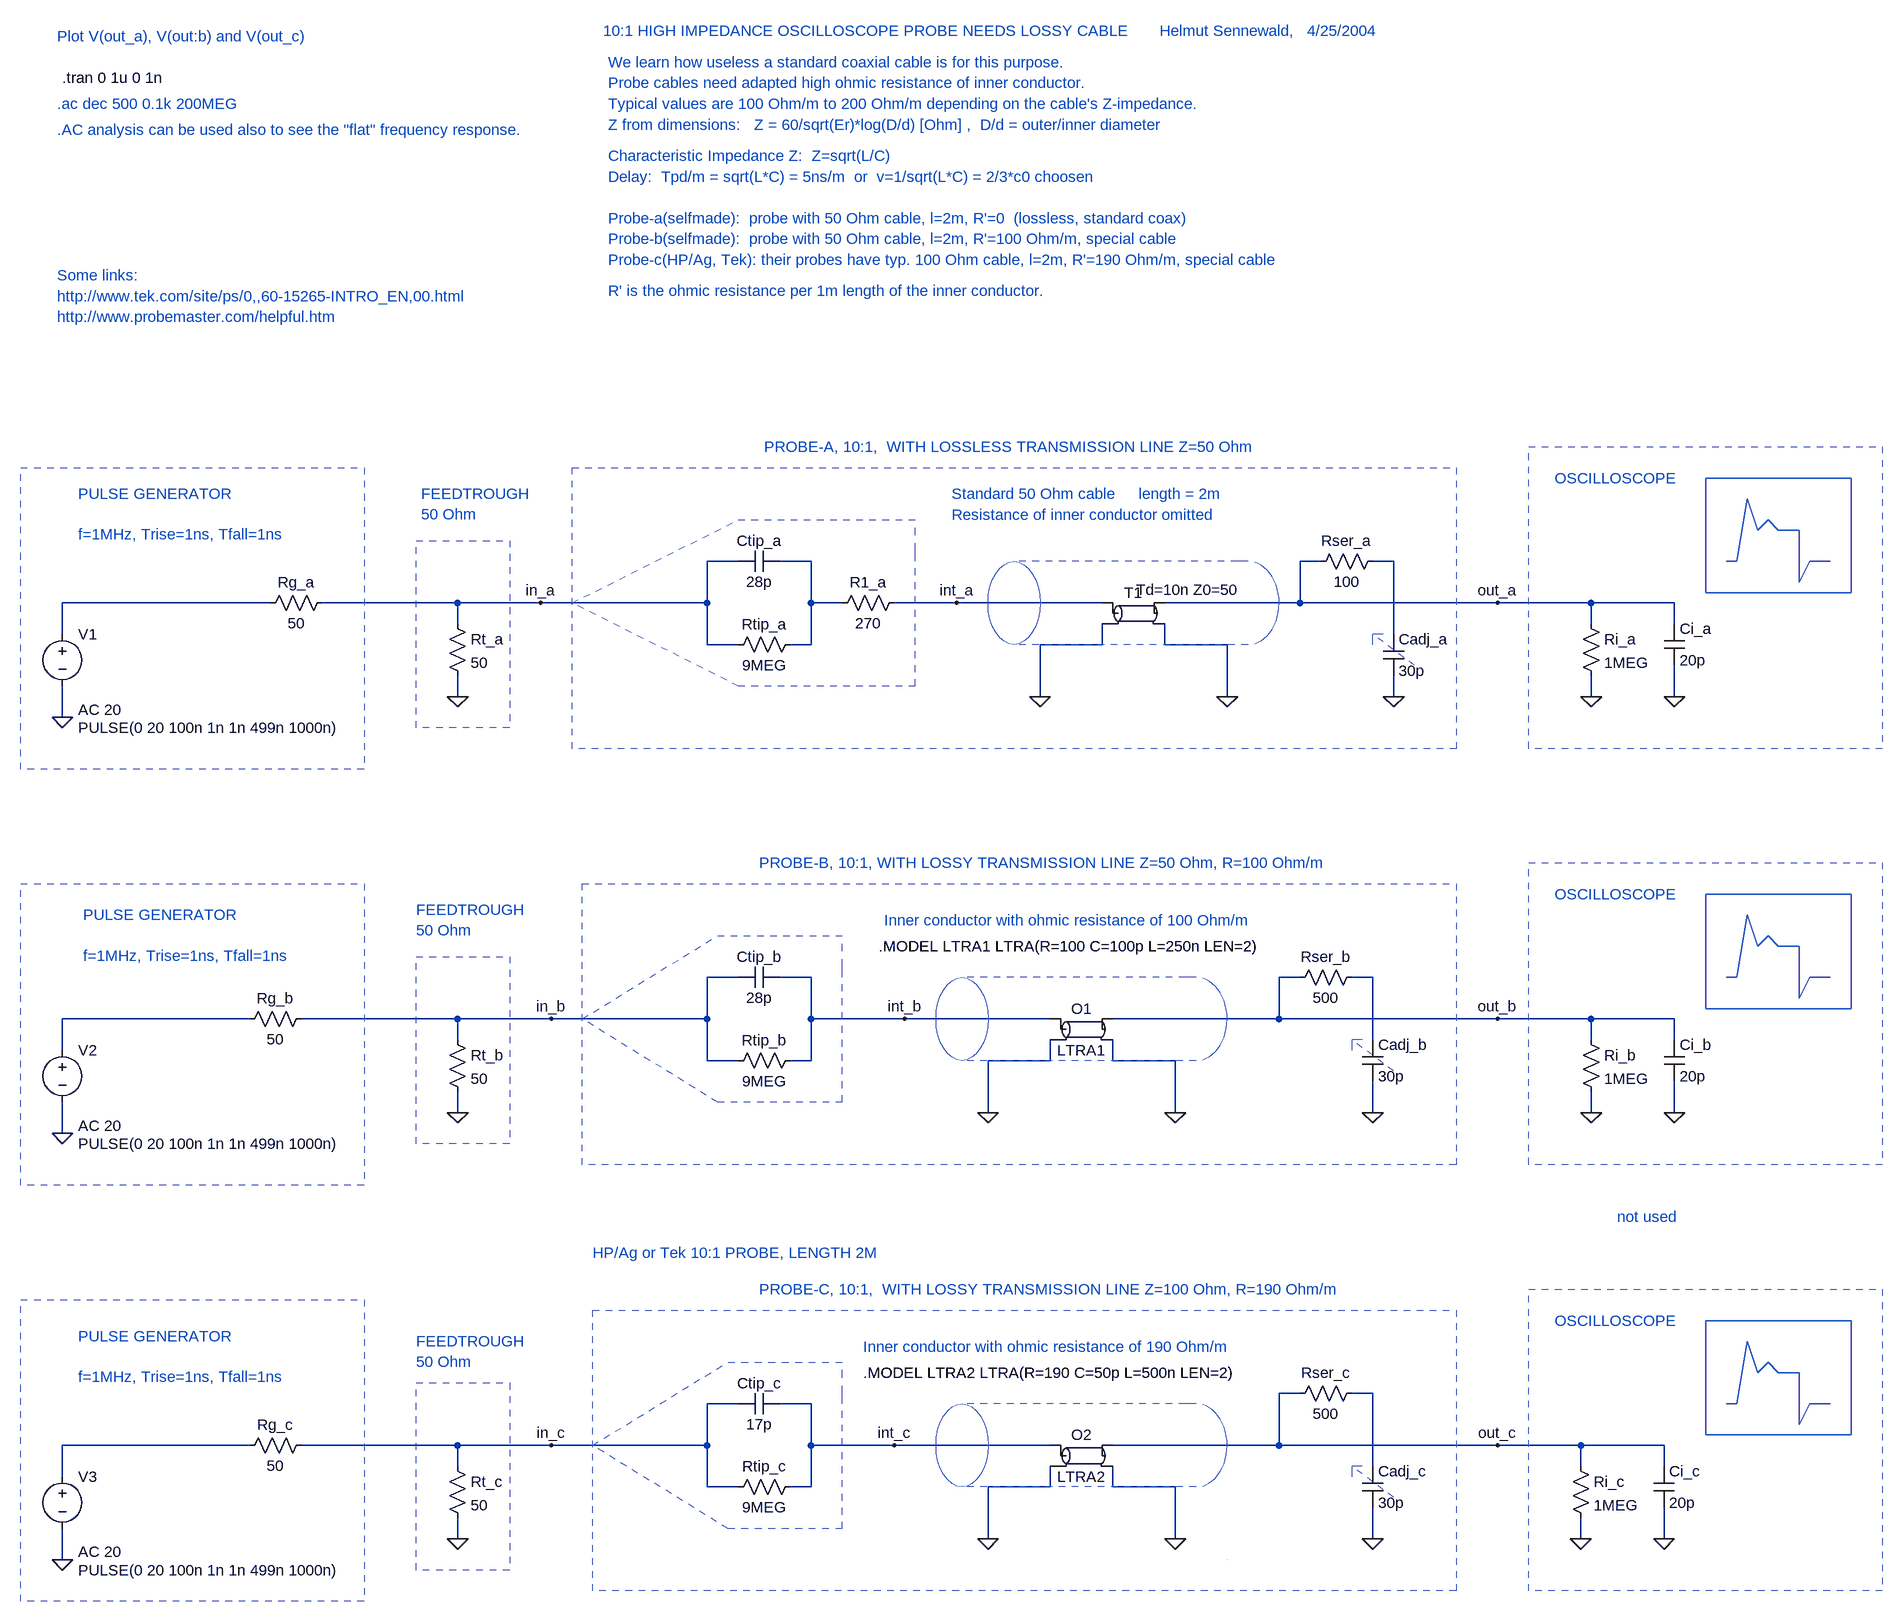
[diagram p0: schematic 10_1_Probe.asc]
10_1_Probe.asc, the LTspice schematic file:
Version 4
SHEET 1 2036 1860
WIRE -80 96 -80 32
WIRE -80 32 -32 32
WIRE 32 32 80 32
WIRE 80 32 80 96
WIRE 528 128 528 160
WIRE 528 96 304 96
WIRE 624 96 832 96
WIRE 1280 96 1280 128
WIRE 1280 208 1280 240
WIRE 976 208 976 240
WIRE -80 96 -336 96
WIRE -1072 96 -1072 144
WIRE -752 96 -1072 96
WIRE -1072 224 -1072 272
WIRE 1280 96 1136 96
WIRE 1408 96 1408 128
WIRE 1408 192 1408 240
WIRE -80 736 -80 672
WIRE -80 672 -32 672
WIRE 32 672 80 672
WIRE 80 672 80 736
WIRE 448 736 224 736
WIRE 544 736 800 736
WIRE 1280 736 1280 768
WIRE 1280 848 1280 880
WIRE 944 832 944 880
WIRE -80 736 -320 736
WIRE -1072 736 -1072 784
WIRE -784 736 -1072 736
WIRE -1072 864 -1072 912
WIRE 1280 736 1136 736
WIRE 1408 736 1408 768
WIRE 1408 832 1408 880
WIRE -320 736 -464 736
WIRE -464 128 -464 96
WIRE -464 208 -464 240
WIRE -464 768 -464 736
WIRE -464 848 -464 880
WIRE -80 1392 -80 1328
WIRE -80 1328 -32 1328
WIRE 32 1328 80 1328
WIRE 80 1328 80 1392
WIRE 448 1392 208 1392
WIRE 544 1392 800 1392
WIRE 1264 1392 1264 1424
WIRE 1264 1504 1264 1536
WIRE 944 1488 944 1536
WIRE -80 1392 -320 1392
WIRE -1072 1392 -1072 1440
WIRE -784 1392 -1072 1392
WIRE -1072 1520 -1072 1568
WIRE 80 1456 80 1392
WIRE 1264 1392 1392 1392
WIRE 1392 1392 1392 1424
WIRE 1392 1488 1392 1536
WIRE -464 1392 -704 1392
WIRE -464 1424 -464 1392
WIRE -464 1504 -464 1536
WIRE 528 160 432 160
WIRE 432 160 432 240
WIRE 624 128 624 160
WIRE 624 160 720 160
WIRE 720 160 720 240
WIRE -464 96 -672 96
WIRE 1280 96 1408 96
WIRE -464 736 -704 736
WIRE -320 1392 -464 1392
WIRE 448 800 352 800
WIRE 352 800 352 880
WIRE 640 800 640 880
WIRE 448 1456 352 1456
WIRE 352 1456 352 1536
WIRE 640 1456 640 1536
WIRE 544 768 544 800
WIRE 544 800 640 800
WIRE 448 768 448 800
WIRE 544 1424 544 1456
WIRE 544 1456 640 1456
WIRE 448 1424 448 1456
WIRE 1280 736 1408 736
WIRE 1136 1392 1264 1392
WIRE 864 32 832 32
WIRE 832 32 832 96
WIRE 832 96 1136 96
WIRE 944 32 976 32
WIRE 976 32 976 144
WIRE 128 96 80 96
WIRE 80 96 80 160
WIRE 80 160 48 160
WIRE -32 160 -80 160
WIRE -80 160 -80 96
WIRE 224 736 80 736
WIRE 912 672 944 672
WIRE 944 672 944 768
WIRE 832 672 800 672
WIRE 800 672 800 736
WIRE 800 736 1136 736
WIRE 80 736 80 800
WIRE 80 800 48 800
WIRE -32 800 -80 800
WIRE -80 800 -80 736
WIRE -32 1456 -80 1456
WIRE -80 1456 -80 1392
WIRE 80 1456 48 1456
WIRE 800 1392 1136 1392
WIRE 944 1424 944 1312
WIRE 944 1312 912 1312
WIRE 832 1312 800 1312
WIRE 800 1312 800 1392
WIRE 208 1392 80 1392
WIRE 304 96 208 96
WIRE -336 96 -464 96
FLAG 432 240 0
FLAG 720 240 0
FLAG -1072 272 0
FLAG 976 240 0
FLAG 1280 240 0
FLAG 1408 240 0
FLAG 1136 96 out_a
FLAG -336 96 in_a
FLAG 304 96 int_a
FLAG -1072 912 0
FLAG 944 880 0
FLAG 1280 880 0
FLAG 1408 880 0
FLAG 1136 736 out_b
FLAG -320 736 in_b
FLAG 224 736 int_b
FLAG -464 240 0
FLAG -464 880 0
FLAG -1072 1568 0
FLAG 944 1536 0
FLAG 1264 1536 0
FLAG 1392 1536 0
FLAG 1136 1392 out_c
FLAG -320 1392 in_c
FLAG 208 1392 int_c
FLAG -464 1536 0
FLAG 352 880 0
FLAG 640 880 0
FLAG 352 1536 0
FLAG 640 1536 0
SYMBOL voltage -1072 128 R0
WINDOW 3 24 160 Left 0
WINDOW 123 24 132 Left 0
WINDOW 39 0 0 Left 0
SYMATTR Value PULSE(0 20 100n 1n 1n 499n 1000n)
SYMATTR Value2 AC 20
SYMATTR InstName V1
SYMBOL res -48 176 R270
WINDOW 0 32 56 VTop 0
WINDOW 3 0 56 VBottom 0
SYMATTR InstName Rtip_a
SYMATTR Value 9MEG
SYMBOL res 1264 112 R0
SYMATTR InstName Ri_a
SYMATTR Value 1MEG
SYMBOL tline 576 112 R0
WINDOW 3 4 -36 Left 0
SYMATTR Value Td=10n Z0=50
SYMATTR InstName T1
SYMBOL cap 960 144 R0
SYMATTR InstName Cadj_a
SYMATTR Value 30p
SYMBOL cap -32 48 R270
WINDOW 0 32 32 VTop 0
WINDOW 3 0 32 VBottom 0
SYMATTR InstName Ctip_a
SYMATTR Value 28p
SYMBOL res -768 112 R270
WINDOW 0 32 56 VTop 0
WINDOW 3 0 56 VBottom 0
SYMATTR InstName Rg_a
SYMATTR Value 50
SYMBOL cap 1392 128 R0
SYMATTR InstName Ci_a
SYMATTR Value 20p
SYMBOL res 848 48 R270
WINDOW 0 32 56 VTop 0
WINDOW 3 0 56 VBottom 0
SYMATTR InstName Rser_a
SYMATTR Value 100
SYMBOL voltage -1072 768 R0
WINDOW 3 24 160 Left 0
WINDOW 123 24 132 Left 0
WINDOW 39 0 0 Left 0
SYMATTR Value PULSE(0 20 100n 1n 1n 499n 1000n)
SYMATTR Value2 AC 20
SYMATTR InstName V2
SYMBOL res -48 816 R270
WINDOW 0 32 56 VTop 0
WINDOW 3 0 56 VBottom 0
SYMATTR InstName Rtip_b
SYMATTR Value 9MEG
SYMBOL res 1264 752 R0
SYMATTR InstName Ri_b
SYMATTR Value 1MEG
SYMBOL cap 928 768 R0
SYMATTR InstName Cadj_b
SYMATTR Value 30p
SYMBOL cap -32 688 R270
WINDOW 0 32 32 VTop 0
WINDOW 3 0 32 VBottom 0
SYMATTR InstName Ctip_b
SYMATTR Value 28p
SYMBOL res -800 752 R270
WINDOW 0 32 56 VTop 0
WINDOW 3 0 56 VBottom 0
SYMATTR InstName Rg_b
SYMATTR Value 50
SYMBOL cap 1392 768 R0
SYMATTR InstName Ci_b
SYMATTR Value 20p
SYMBOL res 816 688 R270
WINDOW 0 32 56 VTop 0
WINDOW 3 0 56 VBottom 0
SYMATTR InstName Rser_b
SYMATTR Value 500
SYMBOL ltline 496 752 R0
SYMATTR InstName O1
SYMATTR Value LTRA1
SYMBOL res -480 112 R0
SYMATTR InstName Rt_a
SYMATTR Value 50
SYMBOL res -480 752 R0
SYMATTR InstName Rt_b
SYMATTR Value 50
SYMBOL voltage -1072 1424 R0
WINDOW 3 24 160 Left 0
WINDOW 123 24 132 Left 0
WINDOW 39 0 0 Left 0
SYMATTR Value PULSE(0 20 100n 1n 1n 499n 1000n)
SYMATTR Value2 AC 20
SYMATTR InstName V3
SYMBOL res -48 1472 R270
WINDOW 0 32 56 VTop 0
WINDOW 3 0 56 VBottom 0
SYMATTR InstName Rtip_c
SYMATTR Value 9MEG
SYMBOL res 1248 1408 R0
SYMATTR InstName Ri_c
SYMATTR Value 1MEG
SYMBOL cap 928 1424 R0
SYMATTR InstName Cadj_c
SYMATTR Value 30p
SYMBOL cap -32 1344 R270
WINDOW 0 32 32 VTop 0
WINDOW 3 0 32 VBottom 0
SYMATTR InstName Ctip_c
SYMATTR Value 17p
SYMBOL res -800 1408 R270
WINDOW 0 32 56 VTop 0
WINDOW 3 0 56 VBottom 0
SYMATTR InstName Rg_c
SYMATTR Value 50
SYMBOL cap 1376 1424 R0
SYMATTR InstName Ci_c
SYMATTR Value 20p
SYMBOL res 816 1328 R270
WINDOW 0 32 56 VTop 0
WINDOW 3 0 56 VBottom 0
SYMATTR InstName Rser_c
SYMATTR Value 500
SYMBOL ltline 496 1408 R0
SYMATTR InstName O2
SYMATTR Value LTRA2
SYMBOL res -480 1408 R0
SYMATTR InstName Rt_c
SYMATTR Value 50
SYMBOL res 112 112 R270
WINDOW 0 32 56 VTop 0
WINDOW 3 0 56 VBottom 0
SYMATTR InstName R1_a
SYMATTR Value 270
TEXT -1080 -672 Left 0 ;.ac dec 500 0.1k 200MEG
TEXT -1072 -712 Left 0 !.tran 0 1u 0 1n
TEXT 184 624 Left 0 !.MODEL LTRA1 LTRA(R=100 C=100p L=250n LEN=2)
TEXT 0 496 Left 0 ;PROBE-B, 10:1, WITH LOSSY TRANSMISSION LINE Z=50 Ohm, R=100 Ohm/m
TEXT 8 -144 Left 0 ;PROBE-A, 10:1,  WITH LOSSLESS TRANSMISSION LINE Z=50 Ohm
TEXT 160 1280 Left 0 !.MODEL LTRA2 LTRA(R=190 C=50p L=500n LEN=2)
TEXT 0 1152 Left 0 ;PROBE-C, 10:1,  WITH LOSSY TRANSMISSION LINE Z=100 Ohm, R=190 Ohm/m
TEXT -240 -784 Left 0 ;10:1 HIGH IMPEDANCE OSCILLOSCOPE PROBE NEEDS LOSSY CABLE
TEXT -232 -496 Left 0 ;Probe-a(selfmade):  probe with 50 Ohm cable, l=2m, R'=0  (lossless, standard coax)
TEXT -232 -464 Left 0 ;Probe-b(selfmade):  probe with 50 Ohm cable, l=2m, R'=100 Ohm/m, special cable
TEXT -232 -432 Left 0 ;Probe-c(HP/Ag, Tek): their probes have typ. 100 Ohm cable, l=2m, R'=190 Ohm/m, special cable
TEXT -232 -384 Left 0 ;R' is the ohmic resistance per 1m length of the inner conductor.
TEXT -1080 -632 Left 0 ;.AC analysis can be used also to see the "flat" frequency response.
TEXT -232 -592 Left 0 ;Characteristic Impedance Z:  Z=sqrt(L/C)
TEXT 1320 1040 Left 0 ;not used
TEXT 1224 -96 Left 0 ;OSCILLOSCOPE
TEXT 584 -72 Left 0 ;length = 2m
TEXT -1048 -72 Left 0 ;PULSE GENERATOR\n \nf=1MHz, Trise=1ns, Tfall=1ns
TEXT -520 -72 Left 0 ;FEEDTROUGH\n50 Ohm
TEXT -528 568 Left 0 ;FEEDTROUGH\n50 Ohm
TEXT -528 1232 Left 0 ;FEEDTROUGH\n50 Ohm
TEXT 1224 1200 Left 0 ;OSCILLOSCOPE
TEXT 1224 544 Left 0 ;OSCILLOSCOPE
TEXT 192 584 Left 0 ;Inner conductor with ohmic resistance of 100 Ohm/m
TEXT 160 1240 Left 0 ;Inner conductor with ohmic resistance of 190 Ohm/m
TEXT 296 -72 Left 0 ;Standard 50 Ohm cable
TEXT 296 -40 Left 0 ;Resistance of inner conductor omitted
TEXT -1040 576 Left 0 ;PULSE GENERATOR\n \nf=1MHz, Trise=1ns, Tfall=1ns
TEXT -1048 1224 Left 0 ;PULSE GENERATOR\n \nf=1MHz, Trise=1ns, Tfall=1ns
TEXT -232 -736 Left 0 ;We learn how useless a standard coaxial cable is for this purpose.
TEXT -232 -704 Left 0 ;Probe cables need adapted high ohmic resistance of inner conductor.
TEXT -232 -560 Left 0 ;Delay:  Tpd/m = sqrt(L*C) = 5ns/m  or  v=1/sqrt(L*C) = 2/3*c0 choosen
TEXT 616 -784 Left 0 ;Helmut Sennewald,   4/25/2004
TEXT -232 -672 Left 0 ;Typical values are 100 Ohm/m to 200 Ohm/m depending on the cable's Z-impedance.
TEXT -232 -640 Left 0 ;Z from dimensions:   Z = 60/sqrt(Er)*log(D/d) [Ohm] ,  D/d = outer/inner diameter
TEXT -256 1096 Left 0 ;HP/Ag or Tek 10:1 PROBE, LENGTH 2M
TEXT -1080 -376 Left 0 ;http://www.tek.com/site/ps/0,,60-15265-INTRO_EN,00.html
TEXT -1080 -344 Left 0 ;http://www.probemaster.com/helpful.htm
TEXT -1080 -408 Left 0 ;Some links:
TEXT -1080 -776 Left 0 ;Plot V(out_a), V(out:b) and V(out_c)
LINE Normal 736 32 400 32 2
LINE Normal 752 32 736 32 2
LINE Normal 752 32 752 32 2
LINE Normal 752 160 400 160 2
LINE Normal -32 -32 240 -32 2
LINE Normal -288 96 -32 -32 2
LINE Normal -32 224 -288 96 2
LINE Normal 240 224 -32 224 2
LINE Normal 240 224 240 224 2
LINE Normal 1504 32 1488 32
LINE Normal 1520 -64 1504 32
LINE Normal 1536 -16 1520 -64
LINE Normal 1552 -32 1536 -16
LINE Normal 1568 -16 1552 -32
LINE Normal 1600 -16 1568 -16
LINE Normal 1600 64 1600 -16
LINE Normal 1616 32 1600 64
LINE Normal 1648 32 1616 32
LINE Normal 656 672 320 672 2
LINE Normal 672 672 656 672 2
LINE Normal 672 672 672 672 2
LINE Normal 656 1328 320 1328 2
LINE Normal 672 1328 656 1328 2
LINE Normal 672 1328 672 1328 2
LINE Normal 672 1456 320 1456 2
LINE Normal 1504 672 1488 672
LINE Normal 1520 576 1504 672
LINE Normal 1536 624 1520 576
LINE Normal 1552 608 1536 624
LINE Normal 1568 624 1552 608
LINE Normal 1600 624 1568 624
LINE Normal 1600 704 1600 624
LINE Normal 1616 672 1600 704
LINE Normal 1648 672 1616 672
LINE Normal 1504 1328 1488 1328
LINE Normal 1520 1232 1504 1328
LINE Normal 1536 1280 1520 1232
LINE Normal 1552 1264 1536 1280
LINE Normal 1568 1280 1552 1264
LINE Normal 1600 1280 1568 1280
LINE Normal 1600 1360 1600 1280
LINE Normal 1616 1328 1600 1360
LINE Normal 1648 1328 1616 1328
LINE Normal 672 624 672 624 2
LINE Normal 672 800 320 800 2
LINE Normal 720 1568 720 1568 2
LINE Normal 240 16 240 -32 2
LINE Normal 240 32 240 16 2
LINE Normal 240 224 240 160 2
LINE Normal 240 160 240 32 2
LINE Normal -64 608 128 608 2
LINE Normal -272 736 -64 608 2
LINE Normal -64 864 -272 736 2
LINE Normal 128 864 -64 864 2
LINE Normal 128 864 128 864 2
LINE Normal 128 656 128 608 2
LINE Normal 128 672 128 656 2
LINE Normal 128 864 128 800 2
LINE Normal 128 800 128 672 2
LINE Normal -48 1264 128 1264 2
LINE Normal -256 1392 -48 1264 2
LINE Normal -48 1520 -256 1392 2
LINE Normal 128 1520 -48 1520 2
LINE Normal 128 1520 128 1520 2
LINE Normal 128 1312 128 1264 2
LINE Normal 128 1328 128 1312 2
LINE Normal 128 1520 128 1456 2
LINE Normal 128 1456 128 1328 2
LINE Normal 1008 192 944 144 2
LINE Normal 960 144 944 144 2
LINE Normal 944 160 944 144 2
LINE Normal 976 816 912 768 2
LINE Normal 928 768 912 768 2
LINE Normal 912 784 912 768 2
LINE Normal 976 1472 912 1424 2
LINE Normal 928 1424 912 1424 2
LINE Normal 912 1440 912 1424 2
RECTANGLE Normal 1728 320 1184 -144 2
RECTANGLE Normal 1680 80 1456 -96
RECTANGLE Normal -608 352 -1136 -112 2
RECTANGLE Normal -384 288 -528 0 2
RECTANGLE Normal -608 992 -1136 528 2
RECTANGLE Normal -608 1632 -1136 1168 2
RECTANGLE Normal -384 928 -528 640 2
RECTANGLE Normal -384 1584 -528 1296 2
RECTANGLE Normal 1728 960 1184 496 2
RECTANGLE Normal 1728 1616 1184 1152 2
RECTANGLE Normal 1680 720 1456 544
RECTANGLE Normal 1680 1376 1456 1200
RECTANGLE Normal 1072 320 -288 -112 1
RECTANGLE Normal 1072 960 -272 528 1
RECTANGLE Normal 1072 1616 -256 1184 1
CIRCLE Normal 432 160 352 32 2
CIRCLE Normal 352 800 272 672 2
CIRCLE Normal 352 1456 272 1328 2
ARC Normal 704 32 800 160 758 133 765 16 2
ARC Normal 624 672 720 800 678 773 685 656 2
ARC Normal 624 1328 720 1456 678 1429 685 1312 2

The netlist it stands for:
* 10_1_Probe.asc
V1 N002 0 PULSE(0 20 100n 1n 1n 499n 1000n) AC 20
Rtip_a in_a N001 9MEG
Ri_a out_a 0 1MEG
T1 int_a 0 out_a 0 Td=10n Z0=50
Cadj_a N005 0 30p
Ctip_a in_a N001 28p
Rg_a N002 in_a 50
Ci_a out_a 0 20p
Rser_a out_a N005 100
V2 N003 0 PULSE(0 20 100n 1n 1n 499n 1000n) AC 20
Rtip_b in_b int_b 9MEG
Ri_b out_b 0 1MEG
Cadj_b N006 0 30p
Ctip_b in_b int_b 28p
Rg_b N003 in_b 50
Ci_b out_b 0 20p
Rser_b out_b N006 500
O1 int_b 0 out_b 0 LTRA1
Rt_a in_a 0 50
Rt_b in_b 0 50
V3 N004 0 PULSE(0 20 100n 1n 1n 499n 1000n) AC 20
Rtip_c in_c int_c 9MEG
Ri_c out_c 0 1MEG
Cadj_c N007 0 30p
Ctip_c in_c int_c 17p
Rg_c N004 in_c 50
Ci_c out_c 0 20p
Rser_c out_c N007 500
O2 int_c 0 out_c 0 LTRA2
Rt_c in_c 0 50
R1_a N001 int_a 270
* .ac dec 500 0.1k 200MEG
.tran 0 1u 0 1n
.MODEL LTRA1 LTRA(R=100 C=100p L=250n LEN=2)
* PROBE-B, 10:1, WITH LOSSY TRANSMISSION LINE Z=50 Ohm, R=100 Ohm/m
* PROBE-A, 10:1,  WITH LOSSLESS TRANSMISSION LINE Z=50 Ohm
.MODEL LTRA2 LTRA(R=190 C=50p L=500n LEN=2)
* PROBE-C, 10:1,  WITH LOSSY TRANSMISSION LINE Z=100 Ohm, R=190 Ohm/m
* 10:1 HIGH IMPEDANCE OSCILLOSCOPE PROBE NEEDS LOSSY CABLE
* Probe-a(selfmade):  probe with 50 Ohm cable, l=2m, R'=0  (lossless, standard coax)
* Probe-b(selfmade):  probe with 50 Ohm cable, l=2m, R'=100 Ohm/m, special cable
* Probe-c(HP/Ag, Tek): their probes have typ. 100 Ohm cable, l=2m, R'=190 Ohm/m, special cable
* R' is the ohmic resistance per 1m length of the inner conductor.
* .AC analysis can be used also to see the "flat" frequency response.
* Characteristic Impedance Z:  Z=sqrt(L/C)
* not used
* OSCILLOSCOPE
* length = 2m
* PULSE GENERATOR
* f=1MHz, Trise=1ns, Tfall=1ns
* FEEDTROUGH
* 50 Ohm
* FEEDTROUGH
* 50 Ohm
* FEEDTROUGH
* 50 Ohm
* OSCILLOSCOPE
* OSCILLOSCOPE
* Inner conductor with ohmic resistance of 100 Ohm/m
* Inner conductor with ohmic resistance of 190 Ohm/m
* Standard 50 Ohm cable
* Resistance of inner conductor omitted
* PULSE GENERATOR
* f=1MHz, Trise=1ns, Tfall=1ns
* PULSE GENERATOR
* f=1MHz, Trise=1ns, Tfall=1ns
* We learn how useless a standard coaxial cable is for this purpose.
* Probe cables need adapted high ohmic resistance of inner conductor.
* Delay:  Tpd/m = sqrt(L*C) = 5ns/m  or  v=1/sqrt(L*C) = 2/3*c0 choosen
* Helmut Sennewald,   4/25/2004
* Typical values are 100 Ohm/m to 200 Ohm/m depending on the cable's Z-impedance.
* Z from dimensions:   Z = 60/sqrt(Er)*log(D/d) [Ohm] ,  D/d = outer/inner diameter
* HP/Ag or Tek 10:1 PROBE, LENGTH 2M
* http://www.tek.com/site/ps/0,,60-15265-INTRO_EN,00.html
* http://www.probemaster.com/helpful.htm
* Some links:
* Plot V(out_a), V(out:b) and V(out_c)
.backanno
.end